# EAGLE design Angelo Dual Filter CTRL v1.1 (EAGLE 7.7.0)
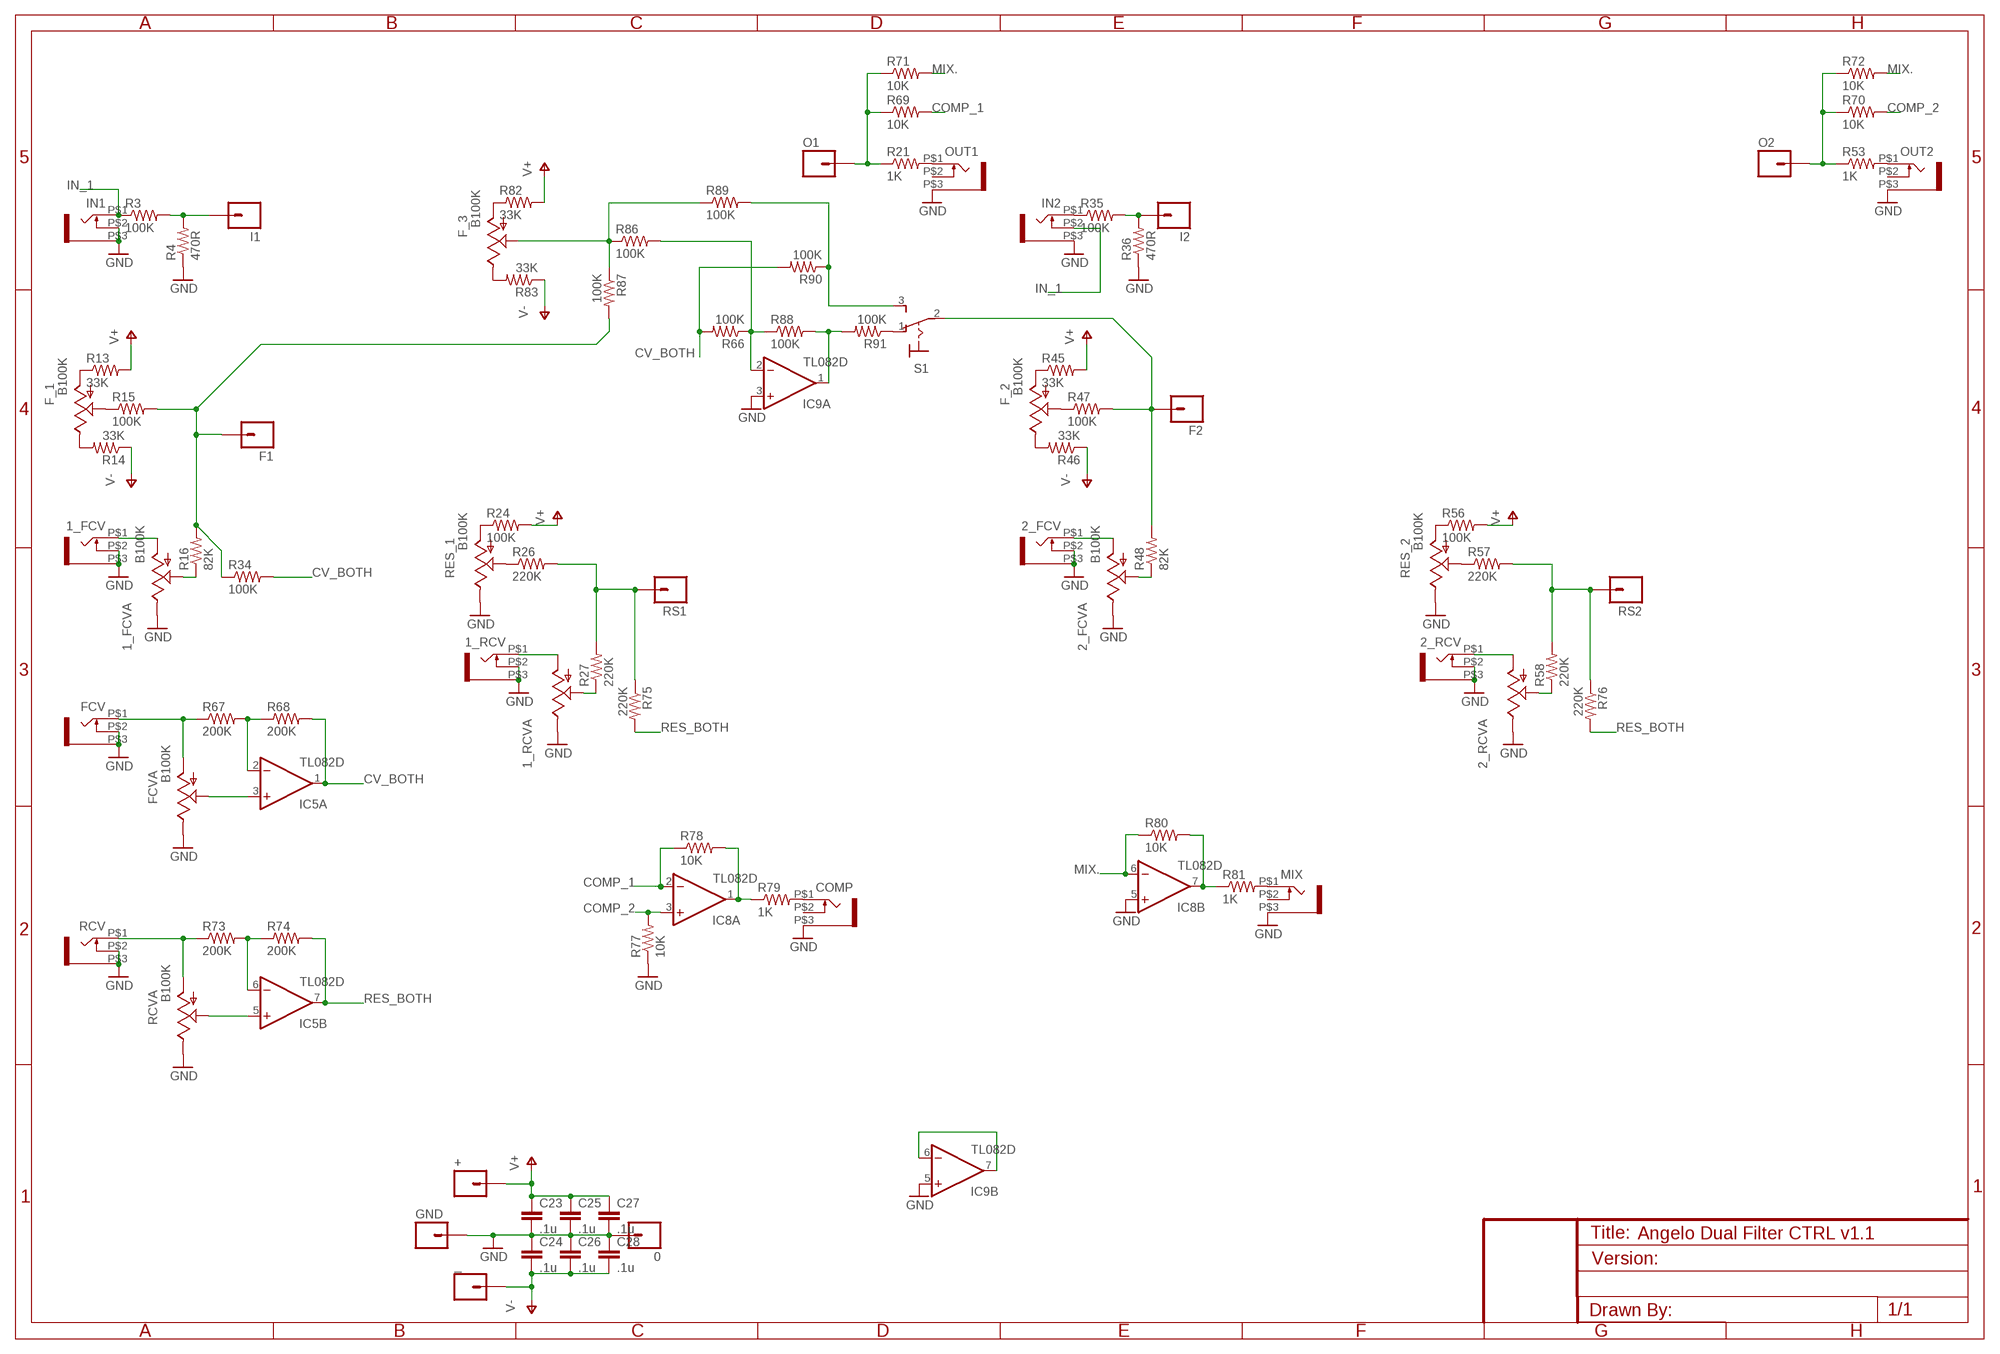
[diagram p0: schematic, sheet 1]

## Parts
0  M01PTH  [1X01]
1_FCV  WQP-PJ301M-12_JACK  [WQP-PJ301M-12_JACK]
1_FCVA  B100K  POT  [ALPS_POT]
1_RCV  WQP-PJ301M-12_JACK  [WQP-PJ301M-12_JACK]
1_RCVA  POT  [ALPS_POT]
2_FCV  WQP-PJ301M-12_JACK  [WQP-PJ301M-12_JACK]
2_FCVA  B100K  POT  [ALPS_POT]
2_RCV  WQP-PJ301M-12_JACK  [WQP-PJ301M-12_JACK]
2_RCVA  POT  [ALPS_POT]
+  M01PTH  [1X01]
_  M01PTH  [1X01]
C23  .1u  CAP0805  [0805]
C24  .1u  CAP0805  [0805]
C25  .1u  CAP0805  [0805]
C26  .1u  CAP0805  [0805]
C27  .1u  CAP0805  [0805]
C28  .1u  CAP0805  [0805]
COMP  WQP-PJ301M-12_JACK  [WQP-PJ301M-12_JACK]
F1  M01PTH  [1X01]
F2  M01PTH  [1X01]
F_1  B100K  POT  [ALPS_POT]
F_2  B100K  POT  [ALPS_POT]
F_3  B100K  POT  [ALPS_POT]
FCV  WQP-PJ301M-12_JACK  [WQP-PJ301M-12_JACK]
FCVA  B100K  POT  [ALPS_POT]
GND  M01PTH  [1X01]
I1  M01PTH  [1X01]
I2  M01PTH  [1X01]
IC5  TL082D  [SO08]
IC8  TL082D  [SO08]
IC9  TL082D  [SO08]
IN1  WQP-PJ301M-12_JACK  [WQP-PJ301M-12_JACK]
IN2  WQP-PJ301M-12_JACK  [WQP-PJ301M-12_JACK]
MIX  WQP-PJ301M-12_JACK  [WQP-PJ301M-12_JACK]
O1  M01PTH  [1X01]
O2  M01PTH  [1X01]
OUT1  WQP-PJ301M-12_JACK  [WQP-PJ301M-12_JACK]
OUT2  WQP-PJ301M-12_JACK  [WQP-PJ301M-12_JACK]
R3  100K  RESISTOR0805-RES  [0805]
R4  470R  RESISTOR0805-RES  [0805]
R13  33K  RESISTOR0805-RES  [0805]
R14  33K  RESISTOR0805-RES  [0805]
R15  100K  RESISTOR0805-RES  [0805]
R16  82K  RESISTOR0805-RES  [0805]
R21  1K  RESISTOR0805-RES  [0805]
R24  100K  RESISTOR0805-RES  [0805]
R26  220K  RESISTOR0805-RES  [0805]
R27  220K  RESISTOR0805-RES  [0805]
R34  100K  RESISTOR0805-RES  [0805]
R35  100K  RESISTOR0805-RES  [0805]
R36  470R  RESISTOR0805-RES  [0805]
R45  33K  RESISTOR0805-RES  [0805]
R46  33K  RESISTOR0805-RES  [0805]
R47  100K  RESISTOR0805-RES  [0805]
R48  82K  RESISTOR0805-RES  [0805]
R53  1K  RESISTOR0805-RES  [0805]
R56  100K  RESISTOR0805-RES  [0805]
R57  220K  RESISTOR0805-RES  [0805]
R58  220K  RESISTOR0805-RES  [0805]
R66  100K  RESISTOR0805-RES  [0805]
R67  200K  RESISTOR0805-RES  [0805]
R68  200K  RESISTOR0805-RES  [0805]
R69  10K  RESISTOR0805-RES  [0805]
R70  10K  RESISTOR0805-RES  [0805]
R71  10K  RESISTOR0805-RES  [0805]
R72  10K  RESISTOR0805-RES  [0805]
R73  200K  RESISTOR0805-RES  [0805]
R74  200K  RESISTOR0805-RES  [0805]
R75  220K  RESISTOR0805-RES  [0805]
R76  220K  RESISTOR0805-RES  [0805]
R77  10K  RESISTOR0805-RES  [0805]
R78  10K  RESISTOR0805-RES  [0805]
R79  1K  RESISTOR0805-RES  [0805]
R80  10K  RESISTOR0805-RES  [0805]
R81  1K  RESISTOR0805-RES  [0805]
R82  33K  RESISTOR0805-RES  [0805]
R83  33K  RESISTOR0805-RES  [0805]
R86  100K  RESISTOR0805-RES  [0805]
R87  100K  RESISTOR0805-RES  [0805]
R88  100K  RESISTOR0805-RES  [0805]
R89  100K  RESISTOR0805-RES  [0805]
R90  100K  RESISTOR0805-RES  [0805]
R91  100K  RESISTOR0805-RES  [0805]
RCV  WQP-PJ301M-12_JACK  [WQP-PJ301M-12_JACK]
RCVA  B100K  POT  [ALPS_POT]
RES_1  B100K  POT  [ALPS_POT]
RES_2  B100K  POT  [ALPS_POT]
RS1  M01PTH  [1X01]
RS2  M01PTH  [1X01]
S1  M9040P  [M9040P]

## Nets
COMP_1: IC8.2(A:-IN) R69.2 R78.1
COMP_2: IC8.3(A:+IN) R70.2 R77.2
CV_BOTH: IC5.1(A:OUT) R34.2 R66.2 R68.2 R90.2
GND: 0.1 1_FCV.P$2 1_FCV.P$3 1_FCVA.P$1(E) 1_RCV.P$2 1_RCV.P$3 1_RCVA.P$1(E) 2_FCV.P$2 2_FCV.P$3 2_FCVA.P$1(E) 2_RCV.P$2 2_RCV.P$3 2_RCVA.P$1(E) C23.2 C24.1 C25.2 C26.1 C27.2 C28.1 COMP.P$3 FCV.P$2 FCV.P$3 FCVA.P$1(E) GND.1 IC8.5(B:+IN) IC9.3(A:+IN) IC9.5(B:+IN) IN1.P$2 IN1.P$3 IN2.P$3 MIX.P$3 OUT1.P$3 OUT2.P$3 R4.1 R36.1 R77.1 RCV.P$2 RCV.P$3 RCVA.P$1(E) RES_1.P$1(E) RES_2.P$1(E)
IN_1: IN1.P$1 IN2.P$2 R3.1
MIX.: IC8.6(B:-IN) R71.2 R72.2 R80.1
N$1: F_3.P$3(A) R82.1
N$2: F_3.P$1(E) R83.2
N$3: I1.1 R3.2 R4.2
N$4: COMP.P$1 R79.2
N$5: F_3.P$2(S) R86.1 R87.1 R89.1
N$6: F2.1 R47.2 R48.2 S1.2(P)
N$7: IC9.2(A:-IN) R66.1 R86.2 R88.1
N$8: IC9.6(B:-IN) IC9.7(B:OUT)
N$9: IC9.1(A:OUT) R88.2 R91.2
N$10: R89.2 R90.1 S1.3(S)
N$11: R91.1 S1.1(O)
N$12: MIX.P$1 R81.2
N$13: F_1.P$3(A) R13.1
N$14: F_1.P$1(E) R14.2
N$15: 1_FCV.P$1 1_FCVA.P$3(A)
N$16: F_1.P$2(S) R15.1
N$17: 1_FCVA.P$2(S) R16.1
N$23: F1.1 R15.2 R16.2 R34.1 R87.2
N$25: O1.1 R21.1 R69.1 R71.1
N$26: OUT1.P$1 R21.2
N$27: R24.1 RES_1.P$3(A)
N$28: R26.2 R27.2 R75.1 RS1.1
N$29: 1_RCV.P$1 1_RCVA.P$3(A)
N$30: R26.1 RES_1.P$2(S)
N$31: 1_RCVA.P$2(S) R27.1
N$44: I2.1 R35.2 R36.2
N$45: IN2.P$1 R35.1
N$53: F_2.P$3(A) R45.1
N$54: F_2.P$1(E) R46.2
N$55: 2_FCV.P$1 2_FCVA.P$3(A)
N$56: F_2.P$2(S) R47.1
N$57: 2_FCVA.P$2(S) R48.1
N$63: O2.1 R53.1 R70.1 R72.1
N$64: OUT2.P$1 R53.2
N$66: R56.1 RES_2.P$3(A)
N$67: 2_RCV.P$1 2_RCVA.P$3(A)
N$68: R57.1 RES_2.P$2(S)
N$69: 2_RCVA.P$2(S) R58.1
N$70: R57.2 R58.2 R76.1 RS2.1
N$84: IC8.7(B:OUT) R80.2 R81.1
N$87: IC5.6(B:-IN) R73.2 R74.1
N$88: R73.1 RCV.P$1 RCVA.P$3(A)
N$89: IC5.5(B:+IN) RCVA.P$2(S)
N$91: IC8.1(A:OUT) R78.2 R79.1
N$93: IC5.2(A:-IN) R67.2 R68.1
N$95: FCV.P$1 FCVA.P$3(A) R67.1
N$96: FCVA.P$2(S) IC5.3(A:+IN)
RES_BOTH: IC5.7(B:OUT) R74.2 R75.2 R76.2
V+: +.1 C23.1 C25.1 C27.1 R13.2 R24.2 R45.2 R56.2 R82.2
V-: _.1 C24.2 C26.2 C28.2 R14.1 R46.1 R83.1
Unconnected: COMP.P$2 MIX.P$2 OUT1.P$2 OUT2.P$2

## Power pins joined to a net without a drawn wire
V+: IC5.8(P:V+) IC8.8(P:V+) IC9.8(P:V+)
V-: IC5.4(P:V-) IC8.4(P:V-) IC9.4(P:V-)

## Library data of the parts
0 + _ F1 F2 GND I1 I2 O1 O2 RS1 RS2 = SparkFun-Connectors:M01: Header 1 Standard 1-pin 0.1" header. Use with straight break away headers (SKU : PRT-00116), right angle break away headers (PRT-00553), swiss pins (PRT-00743), machine pins (PRT-00117), and female headers (PRT-00115).
1_FCV 1_RCV 2_FCV 2_RCV COMP FCV IN1 IN2 MIX OUT1 OUT2 RCV = thonkiconn:WQP-PJ301M-12_JACK
1_FCVA 1_RCVA 2_FCVA 2_RCVA F_1-F_3 FCVA RCVA RES_1 RES_2 = SparkFun-Electromechanical:POT; PROD_ID: RES-09177
C23-C28 = SparkFun-Passives:CAP: Capacitor Standard 0603 ceramic capacitor, and 0.1" leaded capacitor.
IC5 IC8 IC9 = linear:TL082: OP AMP Data sheet <http://www.ti.com/lit/ds/symlink/tl084a . pdf>; DATA_SHEET: <a href="http://www.ti.com/lit/ds/symlink/tl084a.pdf"> Data sheet </a>
R3 R4 R13-R16 R21 R24 R26 R27 R34-R36 R45-R48 R53 R56-R58 R66-R83 R86-R91 = SparkFun-Passives:RESISTOR: Resistor Basic schematic elements and footprints for 0603, 1206, and PTH resistors.
S1 = switch:M9040P: TOGGLE SWITCH Marquardt

## Board
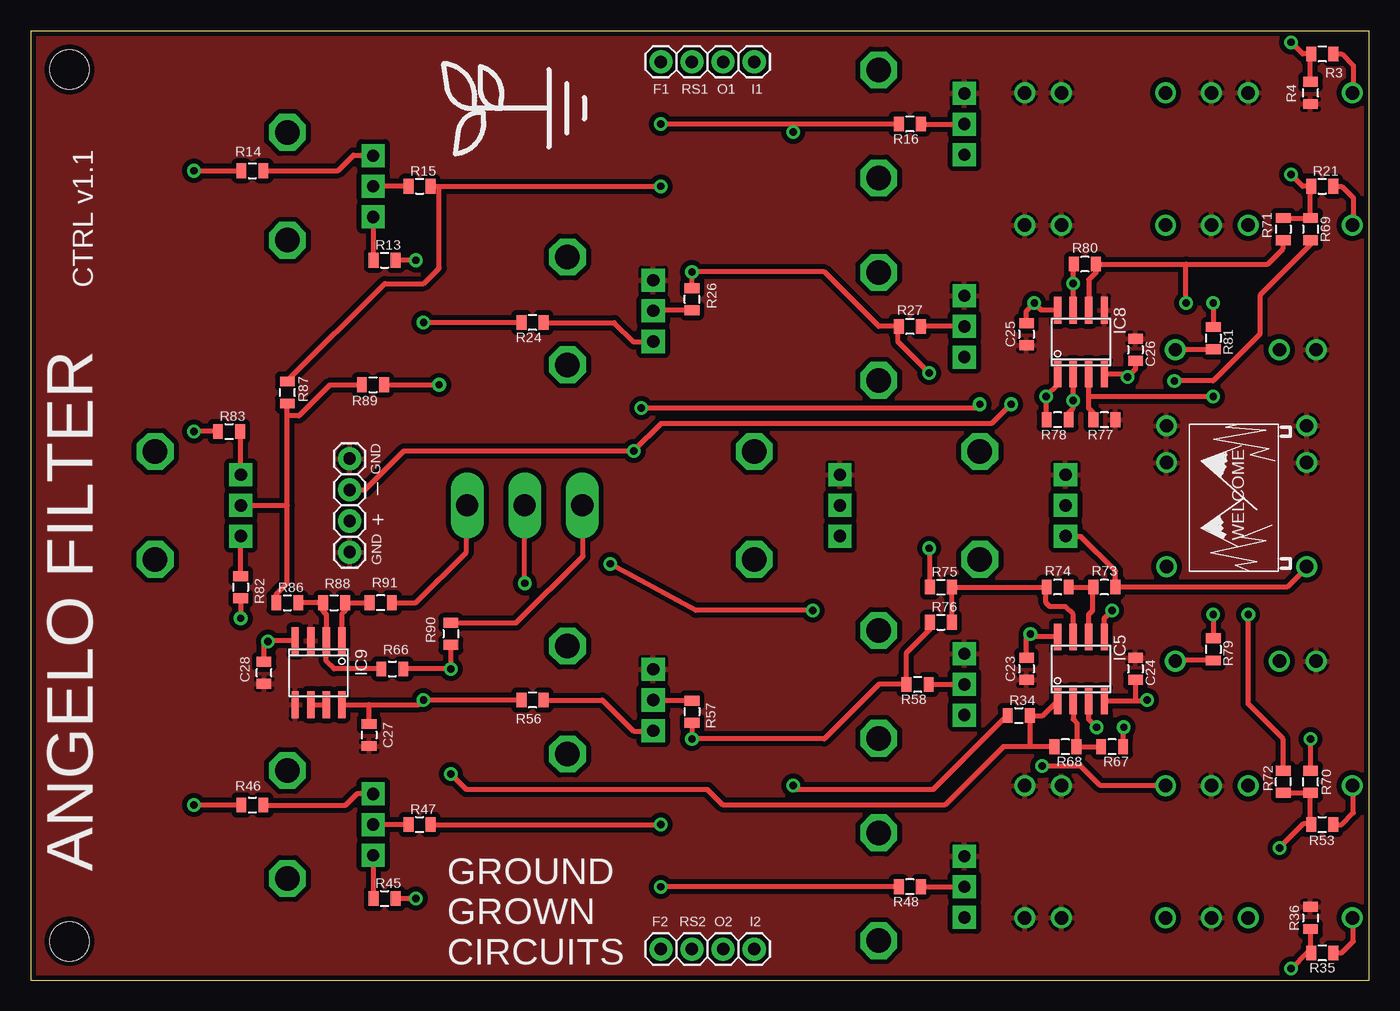
[diagram p1: board, top side]
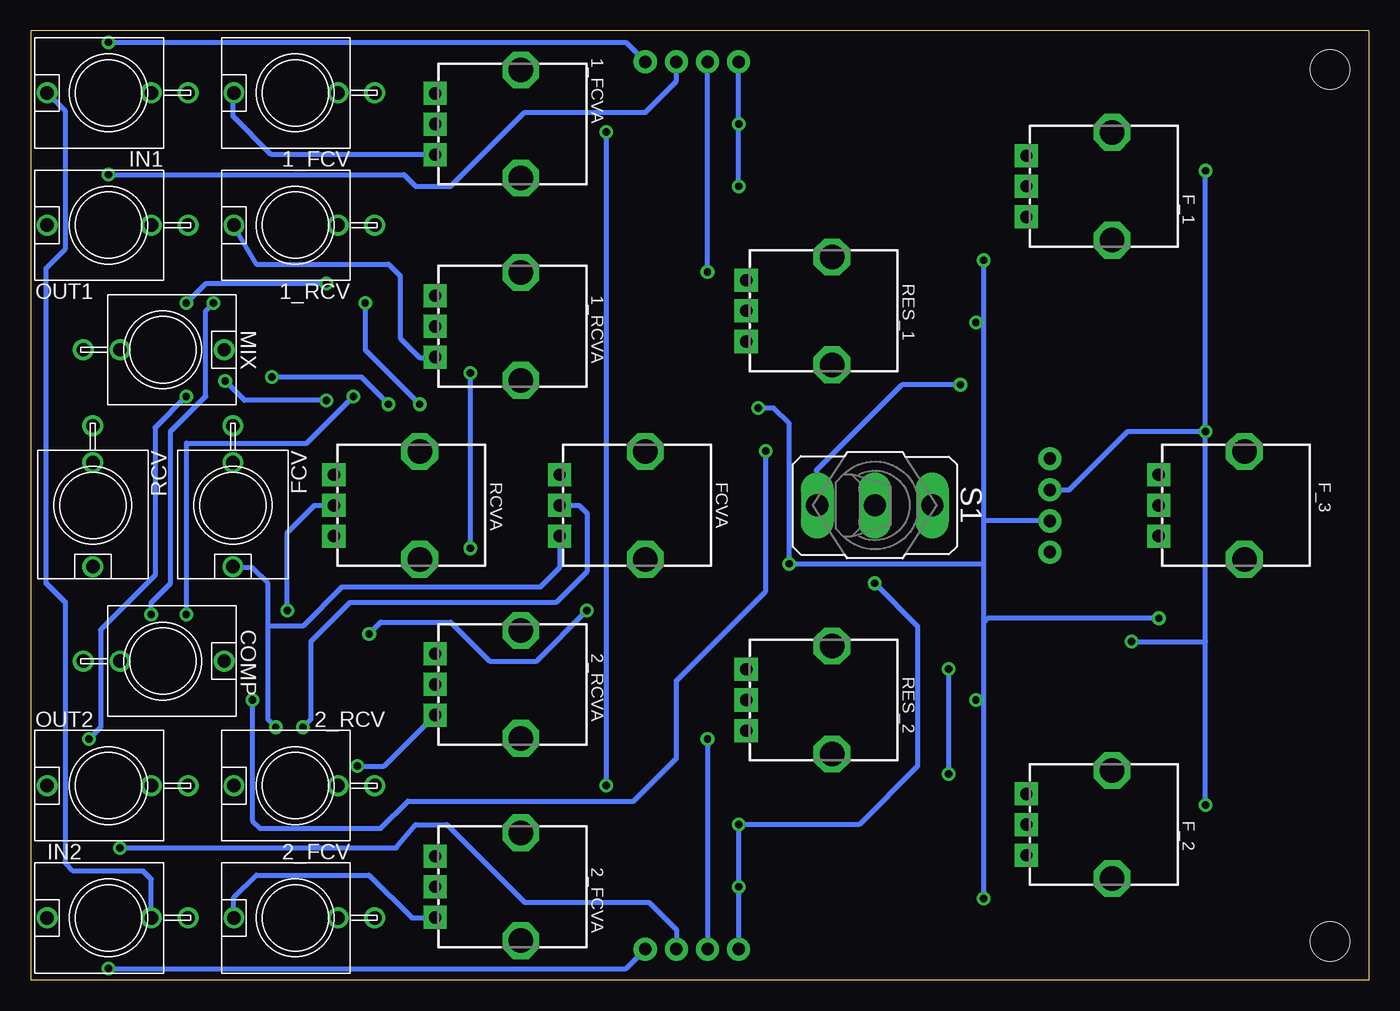
[diagram p2: board, bottom side, seen from below]

Size 109.22 x 77.47 mm. Coordinates in mm from the lower left corner, seen from the top.
Outline: 0,0 109.22,0 109.22,77.47 0,77.47 0,0
Copper layers (1*16): Top 0.035mm / dielectric 1.5mm / Bottom 0.035mm
Design rules "SparkFun": minimum track width 8mil, minimum drill 20mil, track to track 8mil, track to pad 8mil, pad to pad 8mil, via to via 8mil, smd to smd 8mil, copper to edge 8mil, drill to drill 8mil, minimum pad ring 12mil, minimum via ring 10mil, stop-mask expansion 4mil, vias tented up to drill 20mil, thermal gap 10mil
Holes 3.2 mm at 3.17,3.17 3.17,74.3

### Footprints (pad centres in the part's own frame; a part is rotated, then mirrored left to right if it is on the bottom)
1X01 = drill 1.016 pad 1.88: 1 0,0
WQP-PJ301M-12_JACK = drill 1.1: P$1 0,5; P$2 0,-3.5; P$3 0,-6.5
ALPS_POT = drill 1 pad 1.88 square: P$1 7,-2.5; P$2 7,0; P$3 7,2.5 | drill 2 octagon: P$4 0,-4.4; P$5 0,4.4
0805 = smd 0.8 x 1.2: 1 -0.9,0; 2 0.9,0
SO08 = smd 0.6 x 2.2: 1 -1.905,-2.6; 2 -0.635,-2.6; 3 0.635,-2.6; 4 1.905,-2.6; 5 1.905,2.6; 6 0.635,2.6; 7 -0.635,2.6; 8 -1.905,2.6
M9040P = drill 1.803 long: 1 0,4.699; 2 0,0; 3 0,-4.699

### Placement (x,y rotation side)
0  26.04,42.55 90 top
1_FCV  87.63,72.39 90 bottom
1_FCVA  69.22,69.85 180 bottom
1_RCV  87.63,61.59 90 bottom
1_RCVA  69.22,53.34 180 bottom
2_FCV  87.63,5.08 90 bottom
2_FCVA  69.22,7.62 180 bottom
2_RCV  87.63,15.88 90 bottom
2_RCVA  69.22,24.13 180 bottom
+  26.04,37.47 90 top
_  26.04,40.01 90 top
C23  81.28,25.4 270 top
C24  90.17,25.4 270 top
C25  81.28,52.7 270 top
C26  90.17,51.44 270 top
C27  27.62,20 270 top
C28  19.05,25.08 90 top
COMP  98.42,26.04 270 bottom
F1  51.44,74.93 180 top
F2  51.44,2.54 0 top
F_1  20.95,64.77 180 bottom
F_2  20.95,12.7 180 bottom
F_3  10.16,38.73 180 bottom
FCV  92.71,38.73 180 bottom
FCVA  59.05,38.73 180 bottom
GND  26.04,34.92 90 top
I1  59.05,74.93 180 top
I2  59.05,2.54 0 top
IC5  85.72,25.4 0 top
IC8  85.72,52.07 0 top
IC9  23.5,25.08 180 top
IN1  102.87,72.39 90 bottom
IN2  102.87,5.08 90 bottom
MIX  98.42,51.44 270 bottom
O1  56.52,74.93 180 top
O2  56.52,2.54 0 top
OUT1  102.87,61.59 90 bottom
OUT2  102.87,15.88 90 bottom
R3  105.41,75.56 180 top
R4  104.46,72.39 90 top
R13  28.89,58.74 0 top
R14  18.1,66.04 0 top
R15  31.75,64.77 0 top
R16  71.75,69.85 180 top
R21  105.41,64.77 0 top
R24  40.96,53.66 180 top
R26  53.98,55.56 90 top
R27  71.75,53.34 180 top
R34  80.64,21.59 0 top
R35  105.41,2.22 180 top
R36  104.46,5.08 270 top
R45  28.89,6.67 0 top
R46  18.1,14.29 0 top
R47  31.75,12.7 0 top
R48  71.75,7.62 180 top
R53  105.41,12.7 0 top
R56  40.96,22.86 180 top
R57  53.98,21.91 270 top
R58  72.39,24.13 180 top
R66  29.53,25.4 0 top
R67  88.27,19.05 180 top
R68  84.45,19.05 180 top
R69  104.46,61.28 270 top
R70  104.46,16.19 90 top
R71  102.23,61.28 270 top
R72  102.23,16.19 90 top
R73  87.63,32.07 180 top
R74  83.82,32.07 180 top
R75  74.3,32.07 0 top
R76  74.3,29.21 0 top
R77  87.63,45.72 180 top
R78  83.82,45.72 180 top
R79  96.52,26.99 270 top
R80  86.04,58.42 180 top
R81  96.52,52.39 270 top
R82  17.14,32.07 270 top
R83  16.19,44.77 0 top
R86  20.95,30.8 0 top
R87  20.95,47.94 90 top
R88  24.77,30.8 0 top
R89  27.94,48.58 0 top
R90  34.29,28.26 270 top
R91  28.57,30.8 180 top
RCV  104.14,38.73 180 bottom
RCVA  77.47,38.73 180 bottom
RES_1  43.81,54.61 180 bottom
RES_2  43.81,22.86 180 bottom
RS1  53.98,74.93 180 top
RS2  53.98,2.54 0 top
S1  40.32,38.73 270 bottom
U$1  [LOGO_MED]  42.23,71.12 90 top
U$2  [WELCOME_SIGN]  99.06,39.37 90 top

### Tracks (layer width: path | path; a pad name or v marks a point on that pad's centre or on a via)
COMP_1  (via drill 0.6)
  Top 0.406: R78.1 84.72,46.3 85.09,46.67 v85.09,47.31 IC8.2 | R69.2 104.46,60.01 100.33,55.88 100.33,52.7 96.52,48.9 v93.34,48.9
  Bottom 0.406: v85.09,47.31 91.76,47.31 v93.34,48.9
COMP_2  (via drill 0.6)
  Top 0.406: R77.2 86.73,46.3 86.36,46.67 86.36,47.62 | 86.36,47.62 v96.52,47.62 | v104.46,19.68 R70.2 | 86.36,47.62 IC8.3
  Bottom 0.406: v96.52,47.62 99.06,45.09 99.06,33.02 103.5,28.57 103.5,20.64 v104.46,19.68
CV_BOTH  (via drill 0.6)
  Top 0.406: IC5.1 82.61,21.59 R34.2 81.55,19.1 81.6,19.05 | R68.2 81.6,19.05 | 81.6,19.05 79.38,19.05 74.61,14.29 56.52,14.29 55.24,15.56 35.56,15.56 v34.29,16.83 | R66.2 v34.29,25.4 R90.2
  Bottom 0.406: v34.29,16.83 v34.29,25.4
GND
  pour Top (isolate 0.406): 0,0 109.22,0 109.22,77.47 0,77.47
IN_1
  Top 0.406: R3.1 107,75.56 107.95,74.61 107.95,72.47 IN1.P$1
  Bottom 0.406: IN2.P$2 99.37,8.25 100.01,8.89 105.73,8.89 106.36,9.53 106.36,30.8 107.95,32.38 107.95,58.1 106.36,59.69 106.36,70.88 IN1.P$1
MIX.  (via drill 0.6)
  Top 0.406: 94.3,58.42 R80.1 86.94,57.73 86.36,57.15 IC8.6 | 94.3,58.42 100.97,58.42 102.23,59.69 R71.2 | R72.2 102.23,19.68 99.38,22.54 v99.38,29.84 | v94.3,55.24 94.3,58.42
  Bottom 0.406: v99.38,29.84 99.38,30.8 97.79,32.38 97.79,44.77 94.93,47.62 94.93,54.61 v94.3,55.24
N$1
  Top 0.406: R82.1 17.14,36.22 F_3.P$3
N$2
  Top 0.406: R83.2 17.09,41.3 F_3.P$1
N$3  (via drill 0.6)
  Top 0.406: v102.87,76.52 103.82,75.56 R3.2 104.46,75.51 R4.2
  Bottom 0.406: v102.87,76.52 60.64,76.52 I1.1
N$4
  Top 0.406: R79.2 93.48,26.09 COMP.P$1
N$5
  Top 0.406: F_3.P$2 20.95,38.73 | 20.95,38.73 20.95,46.04 | 20.95,46.04 R87.1 | R86.1 20.05,31.48 20.95,32.38 20.95,38.73 | 20.95,46.04 21.91,46.04 24.45,48.58 R89.1
N$6  (via drill 0.6)
  Top 0.406: v51.44,12.7 R47.2 32.7,12.75 | R48.2 v51.44,7.62 | v40.32,32.38 S1.2
  Bottom 0.406: F2.1 v51.44,7.62 v51.44,12.7 41.59,12.7 36.83,17.46 36.83,28.89 v40.32,32.38
N$7
  Top 0.406: R86.2 R88.1 23.86,30.11 24.13,29.84 IC9.2 24.13,26.04 24.77,25.4 R66.1
N$8
  Top 0.406: IC9.6 IC9.7
N$9
  Top 0.406: IC9.1 25.4,29.84 25.66,30.11 R88.2 R91.2
N$10  (via drill 0.6)
  Top 0.406: R89.2 v33.34,48.58 | R90.1 39.63,29.16 45.09,34.61 45.09,38.67 S1.3
  Bottom 0.406: v33.34,48.58 38.1,48.58 45.09,41.59 45.09,38.8 S1.3
N$11
  Top 0.406: R91.1 31.43,30.8 35.56,34.92 35.56,38.67 S1.1
N$12
  Top 0.406: R81.2 96.52,51.44 MIX.P$1
N$13
  Top 0.406: R13.1 27.99,62.23 F_1.P$3
N$14
  Top 0.406: R14.2 25.08,66.04 26.35,67.31 27.91,67.31 F_1.P$1
N$15
  Bottom 0.406: 1_FCVA.P$3 89.58,67.35 92.71,70.48 92.71,72.31 1_FCV.P$1
N$16
  Top 0.406: R15.1 F_1.P$2
N$17
  Top 0.406: R16.1 1_FCVA.P$2
N$23  (via drill 0.6)
  Top 0.406: R15.2 33.34,64.77 | 33.34,64.77 v51.44,64.77 | R87.2 20.95,48.9 28.89,56.83 32.07,56.83 33.34,58.1 33.34,64.77 | R16.2 62.23,69.85 | 62.23,69.85 v51.44,69.85 | R34.1 79.69,21.59 73.66,15.56 62.55,15.56 v62.23,15.88 | v62.23,69.22 62.23,69.85
  Bottom 0.406: v51.44,64.77 v51.44,69.85 F1.1 | v62.23,15.88 v62.23,69.22
N$25  (via drill 0.6)
  Top 0.406: v102.87,65.72 103.82,64.77 R21.1 104.46,64.72 R69.1 R71.1
  Bottom 0.406: v102.87,65.72 78.74,65.72 77.79,64.77 74.93,64.77 68.9,70.8 59.05,70.8 56.52,73.34 O1.1
N$26
  Top 0.406: R21.2 107,64.77 107.95,63.82 107.95,61.67 OUT1.P$1
N$27
  Top 0.406: R24.1 47.62,53.66 49.21,52.07 50.77,52.07 RES_1.P$3
N$28  (via drill 0.6)
  Top 0.406: R26.2 v53.98,57.78 64.77,57.78 69.22,53.34 R27.2 70.8,53.29 70.8,52.07 73.39,49.48 73.39,49.58 v73.34,49.53 | v73.34,35.24 73.34,32.12 R75.1
  Bottom 0.406: v53.98,57.78 RS1.1 | v73.34,49.53 v73.34,35.24
N$29
  Bottom 0.406: 1_RCV.P$1 92.63,61.52 90.81,58.42 80.01,58.42 79.06,57.47 79.06,52.39 77.47,50.8 76.25,50.8 1_RCVA.P$3
N$30
  Top 0.406: R26.1 50.87,54.66 RES_1.P$2
N$31
  Top 0.406: 1_RCVA.P$2 R27.1
N$44  (via drill 0.6)
  Top 0.406: v102.87,0.95 104.14,2.22 R35.2 104.46,2.27 R36.2
  Bottom 0.406: v102.87,0.95 60.64,0.95 I2.1
N$45
  Top 0.406: R35.1 107,2.22 107.95,3.17 107.95,5 IN2.P$1
N$53
  Top 0.406: R45.1 27.99,10.16 F_2.P$3
N$54
  Top 0.406: R46.2 25.72,14.29 26.67,15.24 27.91,15.24 F_2.P$1
N$55
  Bottom 0.406: 2_FCV.P$1 92.63,6.75 90.81,8.57 81.6,8.57 78.11,5.08 76.25,5.08 2_FCVA.P$3
N$56
  Top 0.406: R47.1 F_2.P$2
N$57
  Top 0.406: R48.1 2_FCVA.P$2
N$63  (via drill 0.6)
  Top 0.406: 104.46,12.75 R53.1 | R72.1 R70.1 104.46,12.75 | 104.46,12.75 103.88,12.75 v101.92,10.79
  Bottom 0.406: v101.92,10.79 79.38,10.79 77.79,12.7 75.25,12.7 68.9,6.35 58.74,6.35 56.52,4.13 O2.1
N$64
  Top 0.406: R53.2 107,12.7 107.95,13.65 107.95,15.79 OUT2.P$1
N$66
  Top 0.406: R56.1 46.67,22.86 49.21,20.32 50.77,20.32 RES_2.P$3
N$67  (via drill 0.6)
  Top 0.406: 2_RCV.P$1 87.31,15.88 85.72,17.46 v82.55,17.46
  Bottom 0.406: v82.55,17.46 80.38,17.46 2_RCVA.P$3
N$68
  Top 0.406: R57.1 50.87,22.81 RES_2.P$2
N$69
  Top 0.406: R58.1 2_RCVA.P$2
N$70  (via drill 0.6)
  Top 0.406: R57.2 v53.98,19.68 64.77,19.68 69.22,24.13 R58.2 71.44,24.18 71.44,26.67 73.39,28.63 R76.1
  Bottom 0.406: v53.98,19.68 RS2.1
N$84  (via drill 0.6)
  Top 0.406: IC8.7 v85.09,56.83 85.09,58.37 R80.2 | v96.52,55.24 R81.1
  Bottom 0.406: v85.09,56.83 94.93,56.83 v96.52,55.24
N$87
  Top 0.406: R74.1 R73.2 86.68,31.7 86.68,30.16 86.36,29.84 IC5.6
N$88
  Top 0.406: RCVA.P$3 84.51,36.2 85.72,36.2 88.53,33.39 R73.1 102.55,32.07 104.14,33.66 RCV.P$1
N$89  (via drill 0.6)
  Top 0.406: IC5.5 87.63,29.53 v88.27,30.16
  Bottom 0.406: v88.27,30.16 88.27,36.51 86.04,38.73 RCVA.P$2
N$91  (via drill 0.6)
  Top 0.406: IC8.1 83.82,48.58 v82.87,47.62 82.92,47.57 R78.2 | v96.52,29.84 R79.1
  Bottom 0.406: v96.52,29.84 96.52,43.81 86.68,43.81 v82.87,47.62
N$93
  Top 0.406: IC5.2 85.09,21.27 85.41,20.95 85.41,19.1 R68.1 R67.2
N$95  (via drill 0.6)
  Top 0.406: R67.1 89.17,20.59 v89.22,20.64
  Bottom 0.406: v89.22,20.64 89.85,21.27 89.85,28.89 | 89.85,28.89 89.85,32.38 91.12,33.66 92.63,33.66 FCV.P$1 | FCVA.P$3 66.06,33.64 67.63,32.07 83.82,32.07 87,28.89 89.85,28.89
N$96  (via drill 0.6)
  Top 0.406: v87,20.64 86.36,21.27 IC5.3
  Bottom 0.406: FCVA.P$2 64.45,38.73 63.82,38.1 63.82,33.34 66.36,30.8 83.19,30.8 86.36,27.62 86.36,21.27 v87,20.64
RES_BOTH
  Top 0.406: R76.2 R75.2 R74.2 82.87,31.7 82.87,30.8 83.19,30.48 84.45,30.48 85.09,29.84 IC5.7
V+  (via drill 0.6)
  Top 0.406: R45.2 v31.43,6.67 | v31.43,58.74 R13.2 | R82.2 v17.14,29.53 | R56.2 v32.07,22.86 31.69,22.48 27.62,22.48 | R24.2 v32.07,53.66 | IC5.8 81.86,28 v81.6,28.26 81.28,27.94 C23.1 | v63.82,30.16 54.29,30.16 v47.31,33.97 | IC8.8 82.49,54.67 v81.92,55.24 81.28,54.61 C25.1 | v77.47,46.99 77.15,46.67 v49.85,46.67 | IC9.8 27.62,22.48 | C27.1 27.62,22.48
  Bottom 0.406: +.1 31.43,37.47 | 31.43,37.47 31.43,53.66 | 31.43,53.66 v31.43,58.74 | v31.43,6.67 31.43,22.86 | 31.43,22.86 31.43,29.21 | 31.43,29.21 31.43,33.97 | 31.43,33.97 31.43,37.47 | v17.14,29.53 31.11,29.53 31.43,29.21 | v32.07,22.86 31.43,22.86 | v32.07,53.66 31.43,53.66 | v81.6,28.26 80.64,29.21 74.93,29.21 71.75,26.04 67.94,26.04 v63.82,30.16 | v81.92,55.24 81.92,51.44 v77.47,46.99 | v49.85,46.67 48.58,46.67 47.31,45.4 v47.31,33.97 31.43,33.97
V-  (via drill 0.6)
  Top 0.406: R46.1 v13.34,14.29 | R83.1 v13.34,44.77 | v13.34,66.04 R14.1 | IC5.4 90.17,22.8 | 90.17,22.8 91.06,22.8 v91.12,22.86 | C24.2 90.17,22.8 | IC8.4 89.28,49.47 v89.53,49.21 90.17,49.85 C26.2 | v80.01,46.99 78.42,45.4 51.44,45.4 v49.21,43.18 30.48,43.18 27.3,40.01 _.1 | IC9.4 19.43,27.68 v19.37,27.62 19.05,27.3 C28.2
  Bottom 0.406: _.1 24.45,40.01 19.68,44.77 v13.34,44.77 | v13.34,44.77 v13.34,66.04 | v13.34,14.29 13.34,27.62 | 13.34,27.62 v13.34,44.77 | v91.12,22.86 91.12,13.02 90.49,12.38 80.64,12.38 78.42,14.61 60.01,14.61 56.52,18.1 56.52,24.45 49.21,31.75 v49.21,43.18 | v89.53,49.21 82.23,49.21 v80.01,46.99 | v19.37,27.62 13.34,27.62

### Text on the board
tPlace: CTRL v1.1 | GND | ANGELO FILTER | GROUND / GROWN / CIRCUITS